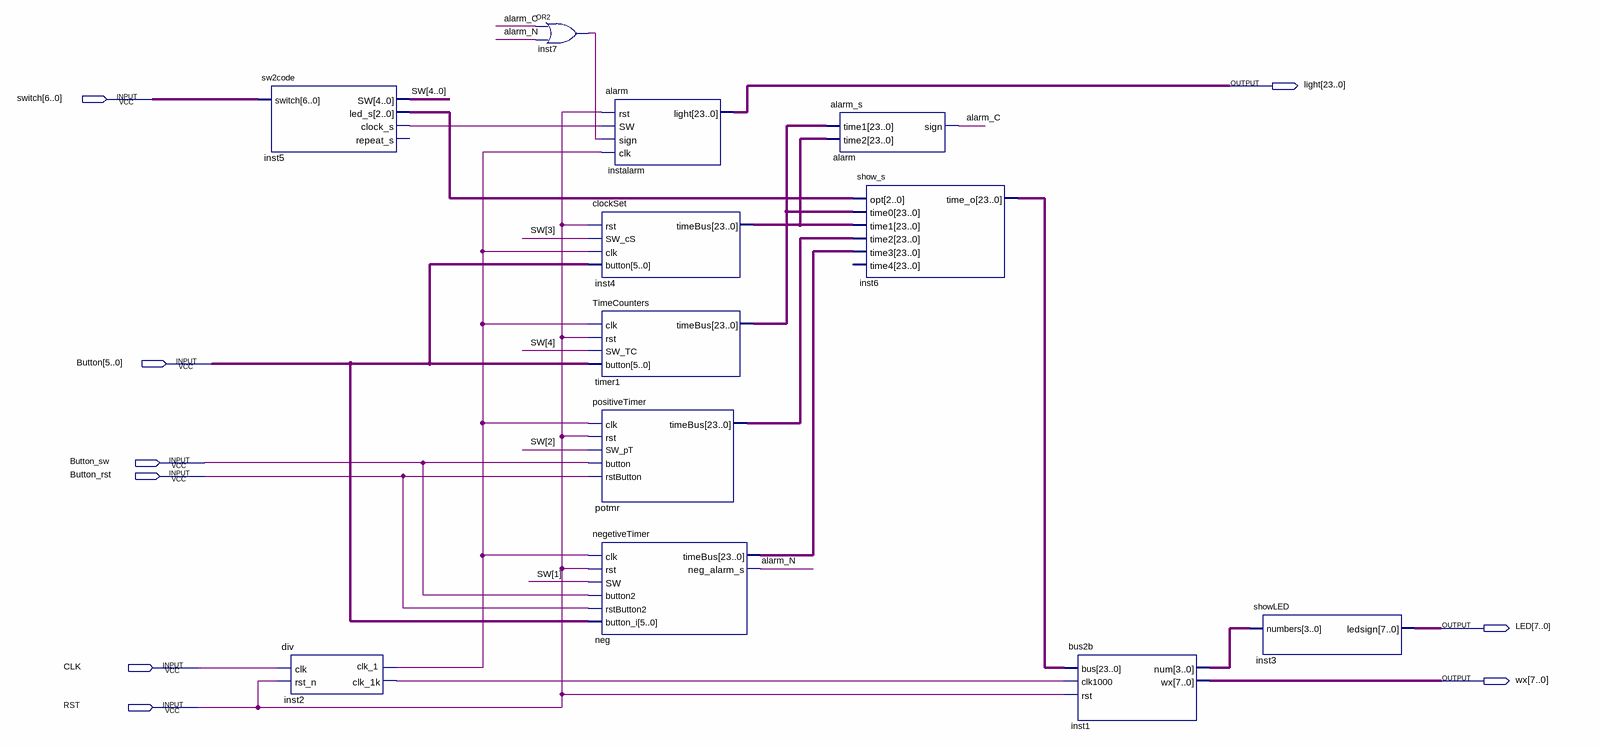
[diagram p0: schematic sheet]
// Quartus schematic aTest.bdf as structural Verilog: 12 symbols, 9 pins
module aTest (
  input  [6:0] switch,
  input  [5:0] Button,
  input  Button_sw,
  input  Button_rst,
  input  CLK,
  input  RST,
  output [23:0] light,
  output [7:0] LED,
  output [7:0] wx
);

  wire alarm_C, alarm_N, inst2_clk_1, inst2_clk_1k, inst5_clock_s, inst7_out;
  wire [2:0] inst5_led_s;
  wire [3:0] inst1_num;
  wire [4:0] SW;
  wire [23:0] inst4_timebus, inst6_time_o, neg_timebus, potmr_timebus, timer1_timebus;

  sw2code inst5 (.switch(switch), .SW(SW), .led_s(inst5_led_s), .clock_s(inst5_clock_s));  // open: repeat_s
  div inst2 (.clk(CLK), .rst_n(RST), .clk_1k(inst2_clk_1k), .clk_1(inst2_clk_1));
  or inst7 (inst7_out, alarm_C, alarm_N);
  alarm instalarm (.rst(RST), .SW(inst5_clock_s), .sign(inst7_out), .clk(inst2_clk_1), .light(light));
  clockSet inst4 (.rst(RST), .SW_cS(SW[3]), .clk(inst2_clk_1), .button(Button), .timeBus(inst4_timebus));
  TimeCounters timer1 (.clk(inst2_clk_1), .rst(RST), .SW_TC(SW[4]), .button(Button), .timeBus(timer1_timebus));
  positiveTimer potmr (
    .clk(inst2_clk_1), .rst(RST), .SW_pT(SW[2]), .button(Button_sw), .rstButton(Button_rst),
    .timeBus(potmr_timebus));
  negetiveTimer neg (
    .clk(inst2_clk_1), .rst(RST), .SW(SW[1]), .button2(Button_sw), .rstButton2(Button_rst),
    .button_i(Button), .timeBus(neg_timebus), .neg_alarm_s(alarm_N));
  alarm_s alarm (.time1(timer1_timebus), .time2(inst4_timebus), .sign(alarm_C));
  show_s inst6 (
    .opt(inst5_led_s), .time0(timer1_timebus), .time1(inst4_timebus), .time2(potmr_timebus),
    .time3(neg_timebus), .time_o(inst6_time_o));  // open: time4
  bus2b inst1 (.bus(inst6_time_o), .clk1000(inst2_clk_1k), .rst(RST), .num(inst1_num), .wx(wx));
  showLED inst3 (.numbers(inst1_num), .ledsign(LED));
endmodule
